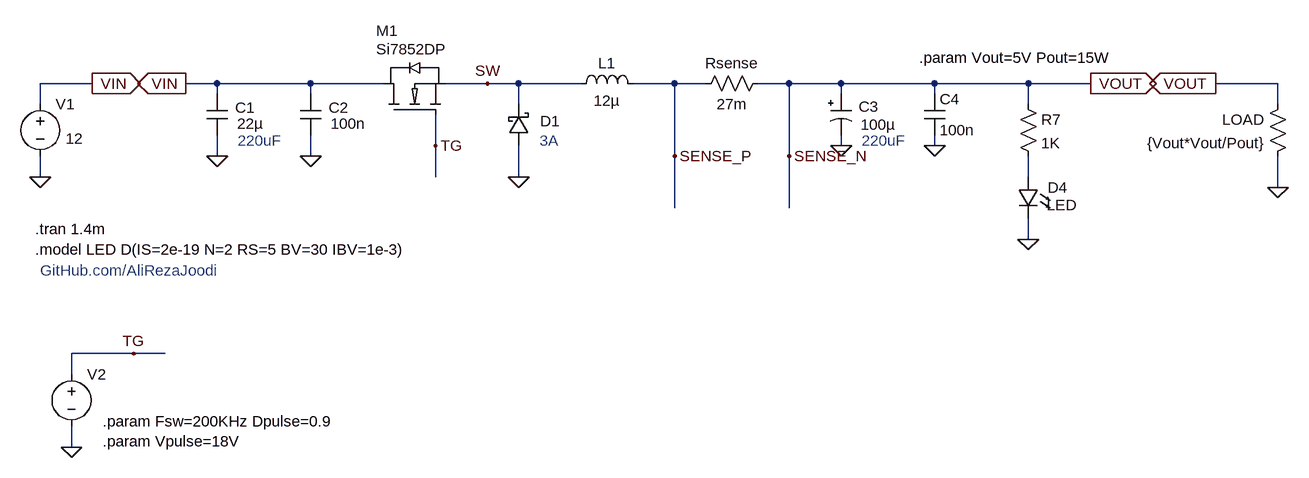
[diagram p0: schematic _PowerStage.asc]
_PowerStage.asc, the LTspice schematic file:
Version 4.1
SHEET 1 3996 1504
WIRE 1520 -48 1440 -48
WIRE 1712 -48 1664 -48
WIRE 1856 -48 1712 -48
WIRE 1968 -48 1856 -48
WIRE 2128 -48 2064 -48
WIRE 2176 -48 2128 -48
WIRE 2272 -48 2176 -48
WIRE 2416 -48 2352 -48
WIRE 2464 -48 2416 -48
WIRE 2592 -48 2544 -48
WIRE 2672 -48 2592 -48
WIRE 2816 -48 2672 -48
WIRE 2960 -48 2816 -48
WIRE 3056 -48 2960 -48
WIRE 3344 -48 3248 -48
WIRE 1712 -32 1712 -48
WIRE 1856 -32 1856 -48
WIRE 2672 -32 2672 -48
WIRE 2816 -32 2816 -48
WIRE 1440 -16 1440 -48
WIRE 2176 -16 2176 -48
WIRE 2960 -16 2960 -48
WIRE 3344 -16 3344 -48
WIRE 2048 48 2048 0
WIRE 2672 48 2672 32
WIRE 2816 48 2816 32
WIRE 1712 64 1712 32
WIRE 1856 64 1856 32
WIRE 2416 64 2416 -48
WIRE 2592 64 2592 -48
WIRE 1440 96 1440 64
WIRE 2048 96 2048 48
WIRE 2176 96 2176 48
WIRE 2960 96 2960 64
WIRE 3344 112 3344 64
WIRE 2416 144 2416 64
WIRE 2592 144 2592 64
WIRE 2960 192 2960 160
WIRE 1584 368 1488 368
WIRE 1632 368 1584 368
WIRE 1488 400 1488 368
WIRE 1488 512 1488 480
FLAG 2672 48 0
FLAG 3344 112 0
FLAG 1440 96 0
FLAG 3056 -48 VOUT
IOPIN 3056 -48 Out
FLAG 1520 -48 VIN
IOPIN 1520 -48 Out
FLAG 2176 96 0
FLAG 1856 64 0
FLAG 2816 48 0
FLAG 2128 -48 SW
FLAG 2048 48 TG
FLAG 2960 192 0
FLAG 1712 64 0
FLAG 2416 64 SENSE_P
FLAG 2592 64 SENSE_N
FLAG 1664 -48 VIN
IOPIN 1664 -48 Out
FLAG 3248 -48 VOUT
IOPIN 3248 -48 Out
FLAG 1488 512 0
FLAG 1584 368 TG
SYMBOL ind 2256 -32 R270
WINDOW 0 32 56 VTop 2
WINDOW 3 5 56 VBottom 2
SYMATTR InstName L1
SYMATTR Value 12µ
SYMATTR SpiceLine Rser=0.025
SYMBOL res 2448 -32 R270
WINDOW 0 32 56 VTop 2
WINDOW 3 0 56 VBottom 2
SYMATTR InstName Rsense
SYMATTR Value 27m
SYMATTR SpiceLine tol=1
SYMBOL voltage 1440 -32 R0
WINDOW 123 24 138 Left 2
WINDOW 39 24 117 Left 2
WINDOW 3 39 69 Left 2
SYMATTR Value 12
SYMATTR InstName V1
SYMBOL res 3360 -32 M0
SYMATTR InstName LOAD
SYMATTR Value {Vout*Vout/Pout}
SYMBOL cap 1840 -32 R0
WINDOW 0 44 21 Left 2
WINDOW 3 47 46 Left 2
SYMATTR InstName C2
SYMATTR Value 100n
SYMATTR SpiceLine V=35
SYMBOL polcap 2656 -32 R0
WINDOW 0 43 20 Left 2
WINDOW 3 46 47 Left 2
SYMATTR InstName C3
SYMATTR Value 100µ
SYMATTR Description Capacitor
SYMATTR Type cap
SYMATTR SpiceLine Rser=0.03
SYMBOL cap 2800 -32 R0
SYMATTR InstName C4
SYMATTR Value 100n
SYMBOL schottky 2160 48 M180
WINDOW 0 49 38 Left 2
WINDOW 3 51 14 Invisible 2
SYMATTR InstName D1
SYMATTR Value SS3P5
SYMBOL LED 2976 96 M0
WINDOW 0 -45 16 Left 2
WINDOW 3 -59 43 Left 2
SYMATTR InstName D4
SYMATTR Value LED
SYMBOL res 2944 -32 R0
SYMATTR InstName R7
SYMATTR Value 1K
SYMBOL cap 1696 -32 R0
WINDOW 0 44 21 Left 2
WINDOW 3 47 46 Left 2
SYMATTR InstName C1
SYMATTR Value 22µ
SYMATTR SpiceLine V=35
SYMBOL voltage 1488 384 R0
WINDOW 3 39 69 Invisible 2
WINDOW 123 0 0 Left 0
SYMATTR Value PULSE(0 {Vpulse} 0 {0.01/Fsw} {0.01/Fsw} {Dpulse/Fsw} {1/Fsw})
SYMATTR InstName V2
SYMATTR SpiceLine Rser=10
SYMBOL MyLib\\Transistor_MOSFET_N\\MOSFET_N 1968 0 R270
WINDOW 0 129 -11 VRight 2
WINDOW 3 101 -11 VRight 2
SYMATTR InstName M1
SYMATTR Value Si7852DP
TEXT 1432 176 Left 2 !.tran 1.4m
TEXT 2208 40 Left 2 ;3A
TEXT 1432 208 Left 2 !.model LED D(IS=2e-19 N=2 RS=5 BV=30 IBV=1e-3)
TEXT 1440 240 Left 2 ;GitHub.com/AliRezaJoodi
TEXT 1744 40 Left 2 ;220uF
TEXT 2704 40 Left 2 ;220uF
TEXT 2792 -88 Left 2 !.param Vout=5V Pout=15W
TEXT 1536 472 Left 2 !.param Fsw=200KHz Dpulse=0.9\n.param Vpulse=18V

The netlist it stands for:
* _PowerStage.asc
L1 SW SENSE_P 12µ Rser=0.025
Rsense SENSE_P SENSE_N 27m tol=1
V1 VIN 0 12
R§LOAD SENSE_N 0 {Vout*Vout/Pout}
C2 VIN 0 100n V=35
C3 SENSE_N 0 100µ Rser=0.03
C4 SENSE_N 0 100n
D1 0 SW SS3P5
D4 N001 0 LED
R7 SENSE_N N001 1K
C1 VIN 0 22µ V=35
V2 TG 0 PULSE(0 {Vpulse} 0 {0.01/Fsw} {0.01/Fsw} {Dpulse/Fsw} {1/Fsw}) Rser=10
M1 VIN TG SW SW Si7852DP
.model D D
.lib standard.dio
.model NMOS NMOS
.model PMOS PMOS
.lib standard.mos
.tran 1.4m
* 3A
.model LED D(IS=2e-19 N=2 RS=5 BV=30 IBV=1e-3)
* GitHub.com/AliRezaJoodi
* 220uF
* 220uF
.param Vout=5V Pout=15W
.param Fsw=200KHz Dpulse=0.9
.param Vpulse=18V
.backanno
.end